# EAGLE design MOSFET PCB (EAGLE 9.2.2)
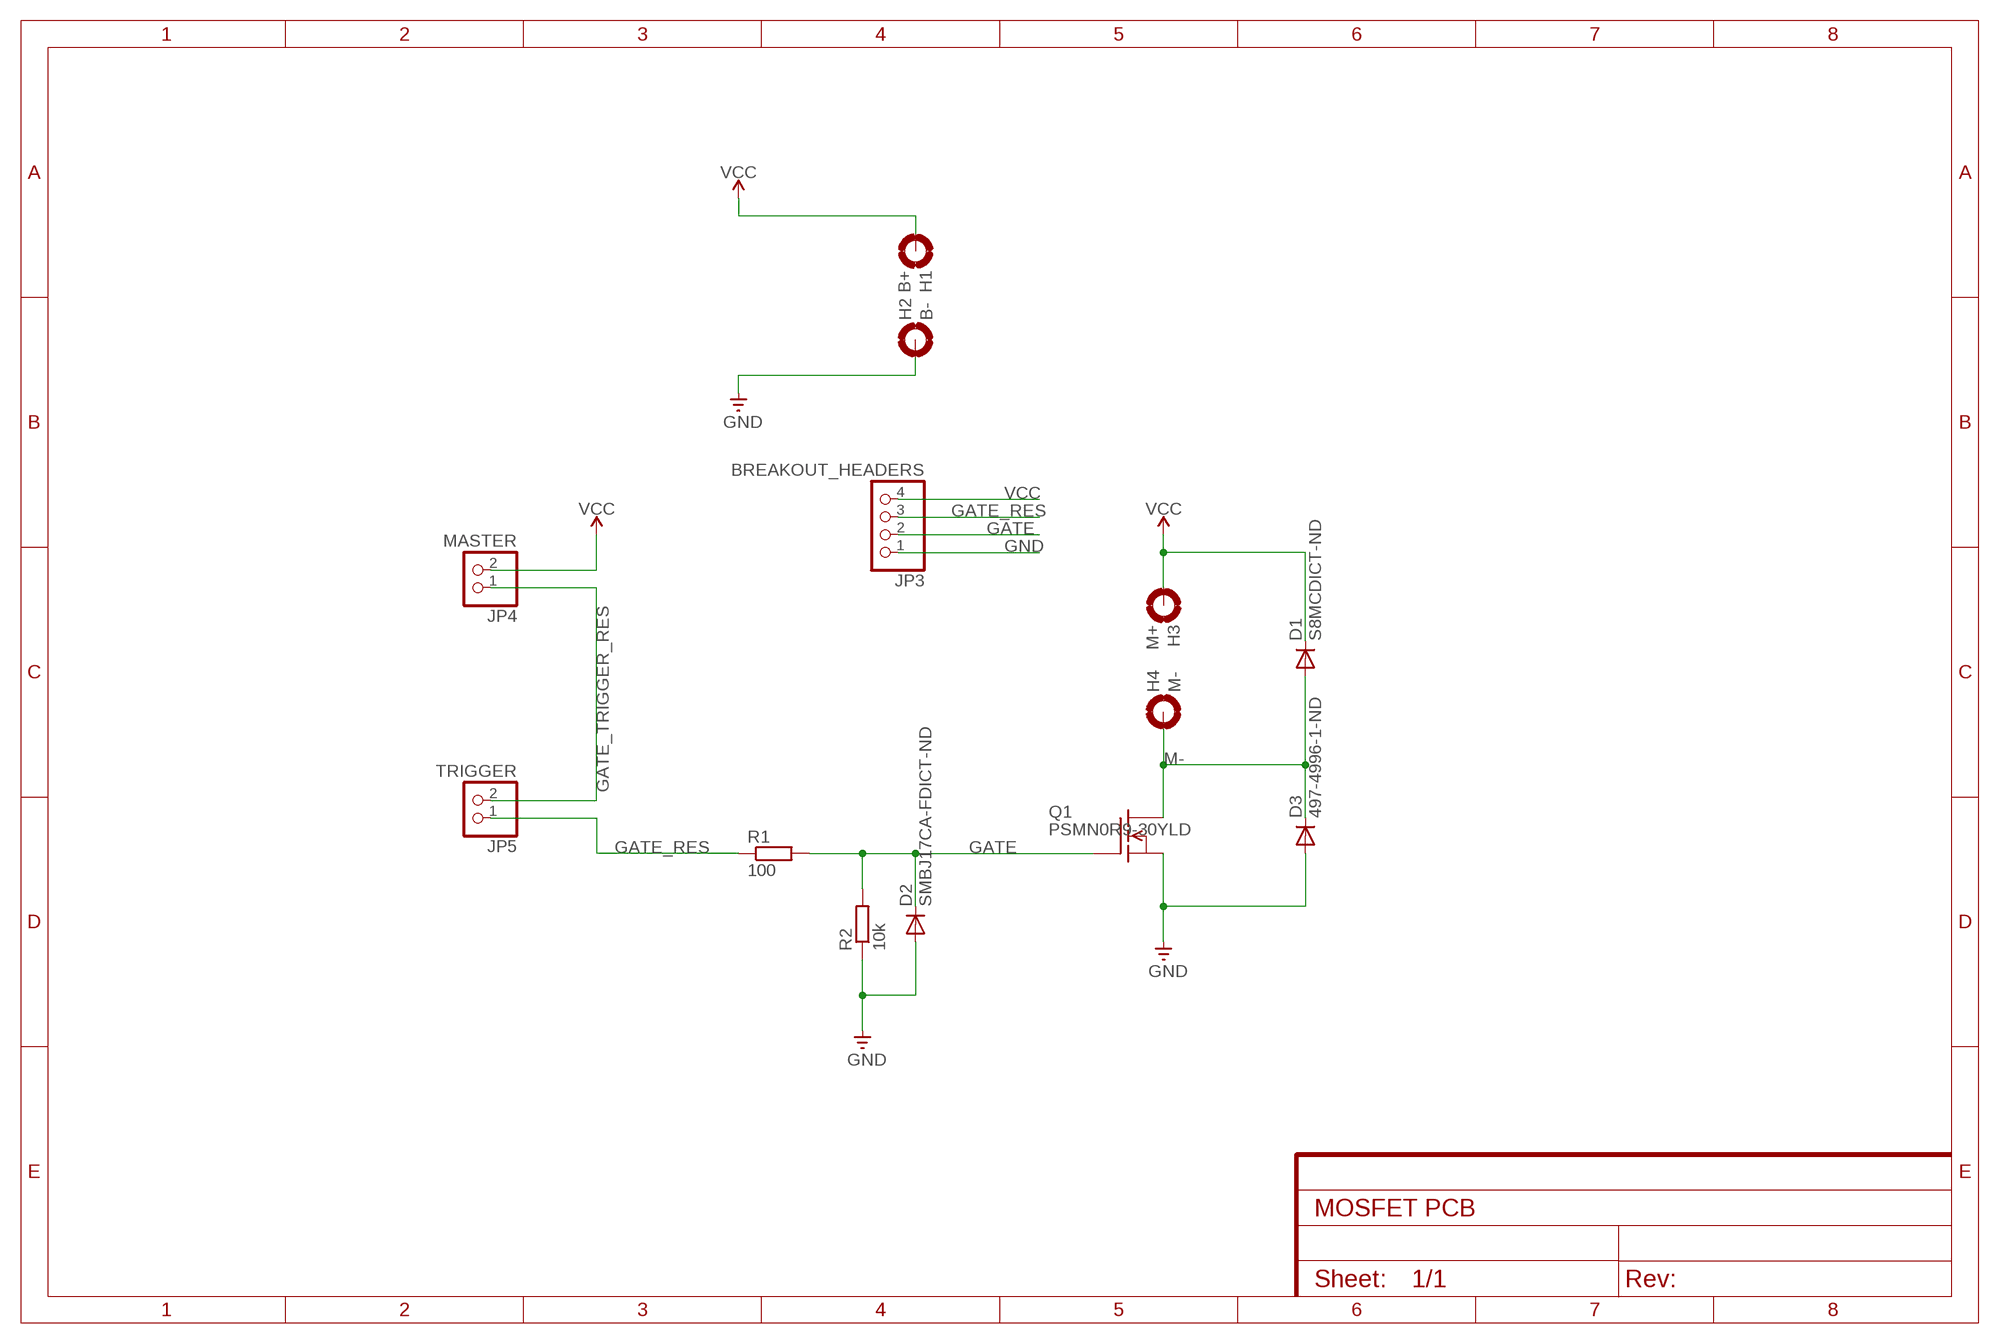
[diagram p0: schematic, sheet 1]

## Parts
D1  S8MCDICT-ND  S3A  [DO214AB]
D2  SMBJ17CA-FDICT-ND  S2A  [DO214AA]
D3  497-4996-1-ND  S3A  [DO214AB]
H1  B+  MOUNT-HOLE-2.5MM  [MOUNT-HOLE-2.5MM]
H2  B-  MOUNT-HOLE-2.5MM  [MOUNT-HOLE-2.5MM]
H3  M+  MOUNT-HOLE-2.5MM  [MOUNT-HOLE-2.5MM]
H4  M-  MOUNT-HOLE-2.5MM  [MOUNT-HOLE-2.5MM]
JP3  BREAKOUT_HEADERS  PINHD-1X4  [1X04]
JP4  MASTER  PINHD-1X2  [1X02]
JP5  TRIGGER  PINHD-1X2  [1X02]
Q1  PSMN0R9-30YLD  [LFPAK-EXTENDED-LEGS]
R1  100  RR1206  [R1206]
R2  10k  RR1206  [R1206]

## Nets
GATE: D2.C JP3.2 Q1.4(G) R1.2 R2.2
GATE_RES: JP3.3 JP5.1 R1.1
GATE_TRIGGER_RES: JP4.1 JP5.2
GND: D2.A D3.A H2.P$1(MOUNT) JP3.1 Q1.1(S) Q1.2(S) Q1.3(S) R2.1
M-: D1.A D3.C H4.P$1(MOUNT) Q1.5(D)
VCC: D1.C H1.P$1(MOUNT) H3.P$1(MOUNT) JP3.4 JP4.2

## Library data of the parts
D1 D3 = s3x_10:S3*: S3A - S3N General Purpose Rectifiers Source: http://www.fairchildsemi.com/datasheets/S3/S3A.pdf; MF: Fairchild; MPN: S3A; OC_FARNELL: 1017803; OC_NEWARK: 58K2395
D2 = s2x_10:S2*: S2A - S2M General Purpose Rectifiers Source: http://www.fairchildsemi.com/datasheets/S2/S2A.pdf; MF: Fairchild; MPN: S2A; OC_FARNELL: 1467485; OC_NEWARK: 58K2391
H1-H4 = my-eagle-lib:MOUNT-HOLE-2.5MM: Mount hole, 1.8mm inner diameter
JP3 = pinhead:PINHD-1X4: PIN HEADER
JP4 JP5 = pinhead:PINHD-1X2: PIN HEADER
Q1 = my-eagle-lib:PSMN0R9-30YLD: Longer pads on base and legs for easier soldering.
R1 R2 = eagle-ltspice:R: RESISTOR, European symbol; SPICEMODEL: NONE; SPICEPREFIX: R

## Board
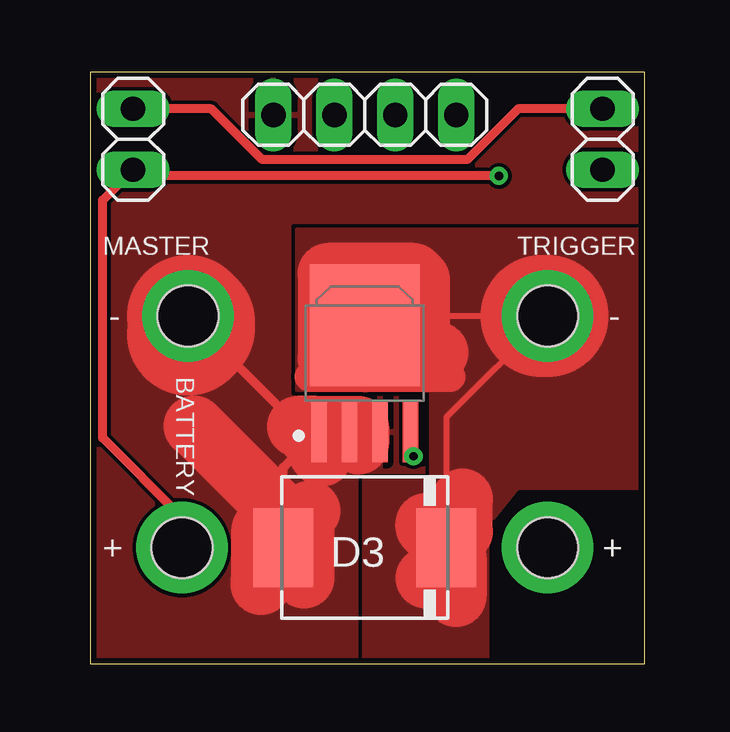
[diagram p1: board, top side]
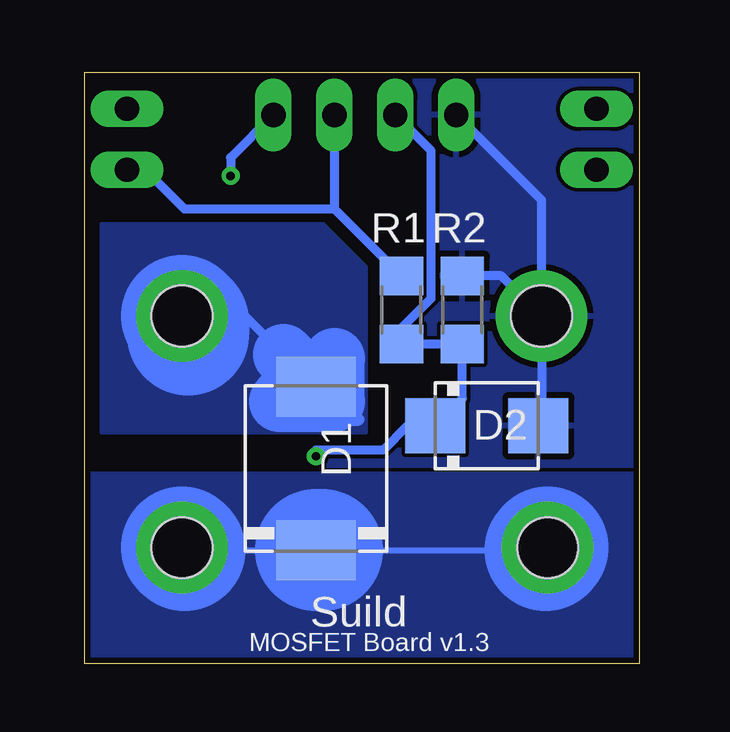
[diagram p2: board, bottom side, seen from below]

Size 23.09 x 24.64 mm. Coordinates in mm from the lower left corner, seen from the top.
Outline: 0,0 23.09,0 23.09,24.64 0,24.64 0,0
Copper layers (1*16): Top 0.035mm / dielectric 1.5mm / Bottom 0.035mm
Design rules "default *": minimum track width 6mil, minimum drill 0.35mm, track to track 6mil, track to pad 6mil, pad to pad 6mil, via to via 6mil, smd to smd 6mil, copper to edge 10mil, drill to drill 6mil, minimum pad ring 10mil, minimum via ring 8mil, stop-mask expansion 4mil, vias tented up to drill 0mil, thermal gap 10mil

### Footprints (pad centres in the part's own frame; a part is rotated, then mirrored left to right if it is on the bottom)
DO214AB = smd 2.5 x 3.3: A 3.4,0; C -3.4,0
DO214AA = smd 2.5 x 2.3: A 2.15,0; C -2.15,0
MOUNT-HOLE-2.5MM = drill 2.54 pad 3.81: P$1 0,0 | hole 2.54: 0,0
1X04 = drill 1.016 long: 1 -3.81,0; 2 -1.27,0; 3 1.27,0; 4 3.81,0
1X02 = drill 1.016 long: 1 -1.27,0; 2 1.27,0
LFPAK-EXTENDED-LEGS = smd 2.54 x 0.635: 1 -3.048,1.905; 2 -3.048,0.635; 3 -3.048,-0.635; 4 -3.048,-1.905 | smd 5.08 x 4.572: 5 1.397,0
R1206 = smd 1.6 x 1.803: 1 -1.422,0; 2 1.422,0

### Placement (x,y rotation side)
D1  13.46,8.13 90 bottom
D2  6.35,9.91 0 bottom
D3  11.43,4.83 180 top
H1  3.81,4.83 0 top
H2  4.06,14.48 0 top
H3  19.05,4.83 0 top
H4  19.05,14.48 0 top
JP3  11.43,22.86 0 top
JP4  1.78,21.84 270 top
JP5  21.34,21.84 90 top
Q1  11.43,12.7 90 top
R1  9.91,14.73 270 bottom
R2  7.37,14.73 270 bottom

### Tracks (layer width: path | path; a pad name or v marks a point on that pad's centre or on a via)
GATE  (via drill 0.35)
  Top 0.381: v13.46,8.64 13.34,8.76 Q1.4
  Bottom 0.381: v13.46,8.64 13.46,8.89 10.67,8.89 9.65,9.91 D2.C 7.37,11.04 R2.2 R1.2 9.91,13.97 8.66,15.21 8.66,21.36 JP3.2
GATE_RES
  Bottom 0.381: JP3.3 12.7,18.95 | 12.7,18.95 R1.1 | JP5.1 20.57,20.57 18.95,18.95 12.7,18.95
GATE_TRIGGER_RES
  Top 0.381: JP5.2 17.82,23.11 15.7,20.99 7.16,20.99 5.04,23.11 JP4.1
GND
  Top 0.381: Q1.3 Q1.2 Q1.1 | D3.A 8.03,8.16 9.21,9.33 | H2.P$1 4.32,14.22 8.64,9.91
  Top 2.54: 4.32,9.91 8.03,6.19 D3.A 8.03,4.22 7.11,3.3 7.11,3.42 7.14,3.45 7.14,5.59 8.38,5.59 8.89,6.1 | 9.14,6.35 8.89,6.1 | 8.89,6.1 8.89,3.56 | Q1.1 9.52,8.76 9.65,8.64 9.65,9.65 9.42,9.88 | 9.42,9.88 8.64,9.88 | 9.42,9.88 11.18,9.88 11.18,9.14 10.99,9.33 9.21,9.33
  Top 5.08: H2.P$1 4.06,13.72 4.32,13.97 4.32,14.22
  Bottom 0.381: R2.1 5.74,16.15 H2.P$1 | H2.P$1 4.06,10.04 D2.A | H2.P$1 4.06,19.3 JP3.1
  pour Top (rank 2): 0,24.64 23.11,24.64 23.11,0 0,0
  pour Bottom (rank 2): 0,24.64 23.11,24.64 23.11,0 0,0
M-
  Top 0.254: 18.8,14.48 11.81,14.48 Q1.5 | H4.P$1 14.83,10.26 D3.C
  Top 0.508: D3.C 14.22,4.83
  Top 1.27: Q1.5 9.27,11.94 | 9.27,11.94 9.14,11.94 | 9.27,11.94 14.99,11.94
  Top 2.54: D3.C 15.49,5.49 15.49,6.86 | D3.C 15.24,4.42 15.24,2.79 | D3.C 14.83,4.42 13.97,3.56 | D3.C 13.97,5.69 13.97,5.84 | Q1.5 12.57,14.1 13.72,12.95 | 13.97,12.7 13.72,12.95 | 13.72,12.95 13.72,16 13.46,16.26 9.91,16.26 9.91,12.7 14.22,12.7 14.48,12.95
  Top 5.08: H4.P$1 18.8,14.48
  Bottom 0.381: H4.P$1 16.41,14.48 14.81,12.88
  Bottom 0.508: D1.A 12.09,10.16 11.68,10.16
  Bottom 2.54: 14.81,12.88 D1.A 14.38,11.53 14.99,10.92 12.7,10.92 12.7,12.7
  Bottom 5.08: H4.P$1 18.8,14.22 18.8,13.72
  pour Bottom: 11.43,12.95 11.43,9.65 22.35,9.65 22.35,18.29 13.21,18.29 11.43,16.51
  pour Top: 8.64,11.43 14.22,11.43 14.22,7.62 11.43,7.62 11.43,0 16.51,0 16.51,6.1 16.76,6.1 17.78,7.37 23.11,7.37 23.11,18.03 8.64,18.03
VCC  (via drill 0.35)
  Top 0.381: H1.P$1 3.81,6.1 0.51,9.4 0.51,19.3 JP4.2 2.03,20.32 v17.02,20.32
  Bottom 0.254: 13.21,4.73 3.91,4.73 | 18.95,4.73 D1.C
  Bottom 0.381: 13.21,4.83 13.36,4.83 D1.C | JP3.4 17.02,21.08 v17.02,20.32
  Bottom 5.08: D1.C 13.21,4.73 | H3.P$1 18.95,4.73 | H1.P$1 3.91,4.73
  pour Bottom: 0,7.87 23.11,7.87 23.11,0 0,0.04

### Text on the board
tNames: MASTER | TRIGGER | - | - | BATTERY | + | +
bNames: Suild | MOSFET Board v1.3